# Altium schematic sheet BuySellDisplay.SchDoc
size A4
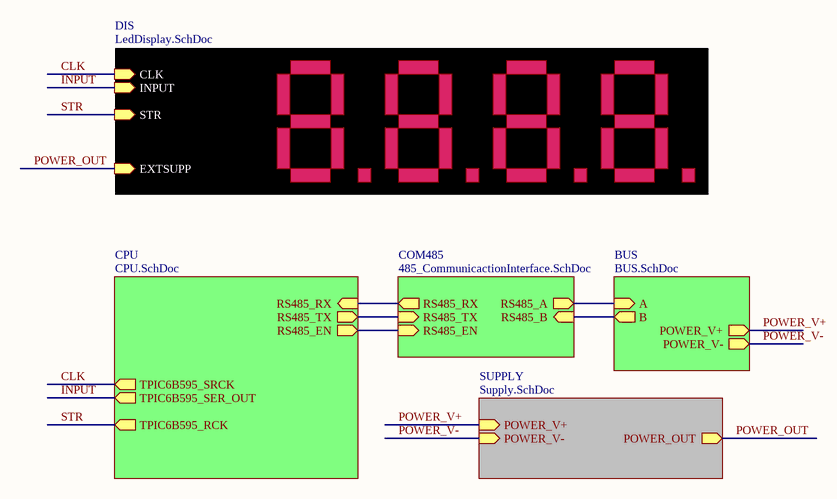
[diagram p0: BuySellDisplay.SchDoc]

## Sub-sheets
BUS = BUS.SchDoc: A (in), B (out), POWER_V+ (out), POWER_V- (out)
COM485 = 485_CommunicactionInterface.SchDoc: RS485_RX (out), RS485_TX (in), RS485_EN (in), RS485_A (out), RS485_B (in)
CPU = CPU.SchDoc: RS485_RX (in), RS485_TX (out), RS485_EN (out), TPIC6B595_SRCK (out), TPIC6B595_SER_OUT (out), TPIC6B595_RCK (out)
DIS = LedDisplay.SchDoc: CLK (in), INPUT (in), STR (in), EXTSUPP (in)
SUPPLY = Supply.SchDoc: POWER_V+ (in), POWER_V- (in), POWER_OUT (out)

## Nets
CLK: sheet CPU/TPIC6B595_SRCK, sheet DIS/CLK
INPUT: sheet CPU/TPIC6B595_SER_OUT, sheet DIS/INPUT
POWER_OUT: sheet DIS/EXTSUPP, sheet SUPPLY/POWER_OUT
POWER_V+: sheet BUS/POWER_V+, sheet SUPPLY/POWER_V+
POWER_V-: sheet BUS/POWER_V-, sheet SUPPLY/POWER_V-
STR: sheet CPU/TPIC6B595_RCK, sheet DIS/STR
(unnamed): sheet CPU/RS485_RX, sheet COM485/RS485_RX
(unnamed): sheet CPU/RS485_TX, sheet COM485/RS485_TX
(unnamed): sheet CPU/RS485_EN, sheet COM485/RS485_EN
(unnamed): sheet COM485/RS485_A, sheet BUS/A
(unnamed): sheet COM485/RS485_B, sheet BUS/B